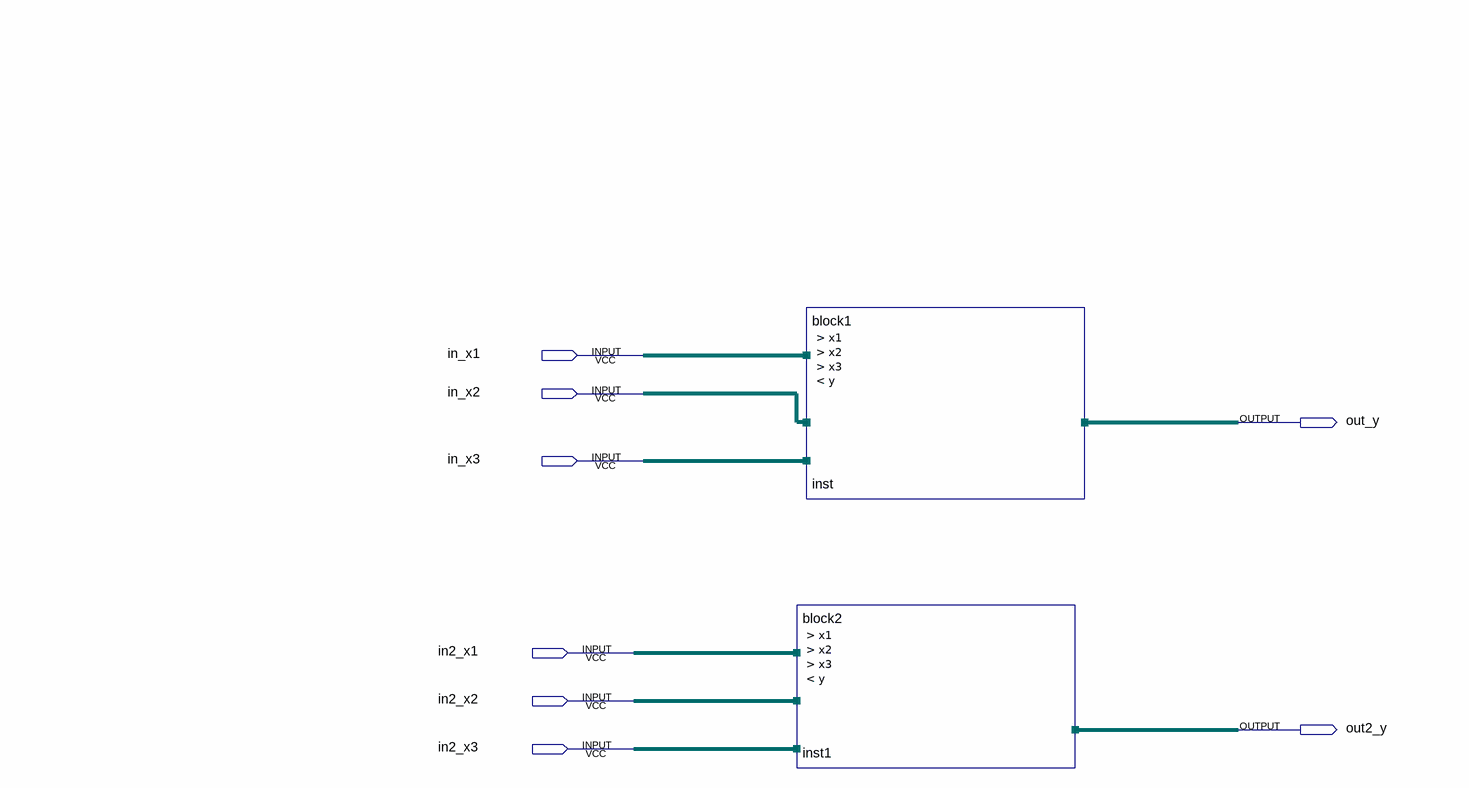
[diagram p0: schematic sheet]
// Quartus schematic cdlab1.bdf as structural Verilog: 2 symbols, 8 pins
module cdlab1 (
  input  in_x1,
  input  in_x2,
  input  in_x3,
  input  in2_x1,
  input  in2_x2,
  input  in2_x3,
  output out_y,
  output out2_y
);

  block1 inst (.x1(in_x1), .x2(in_x2), .x3(in_x3), .y(out_y));
  block2 inst1 (.x1(in2_x1), .x2(in2_x2), .x3(in2_x3), .y(out2_y));
endmodule
